# EAGLE design 4port_driver (EAGLE 6.2)
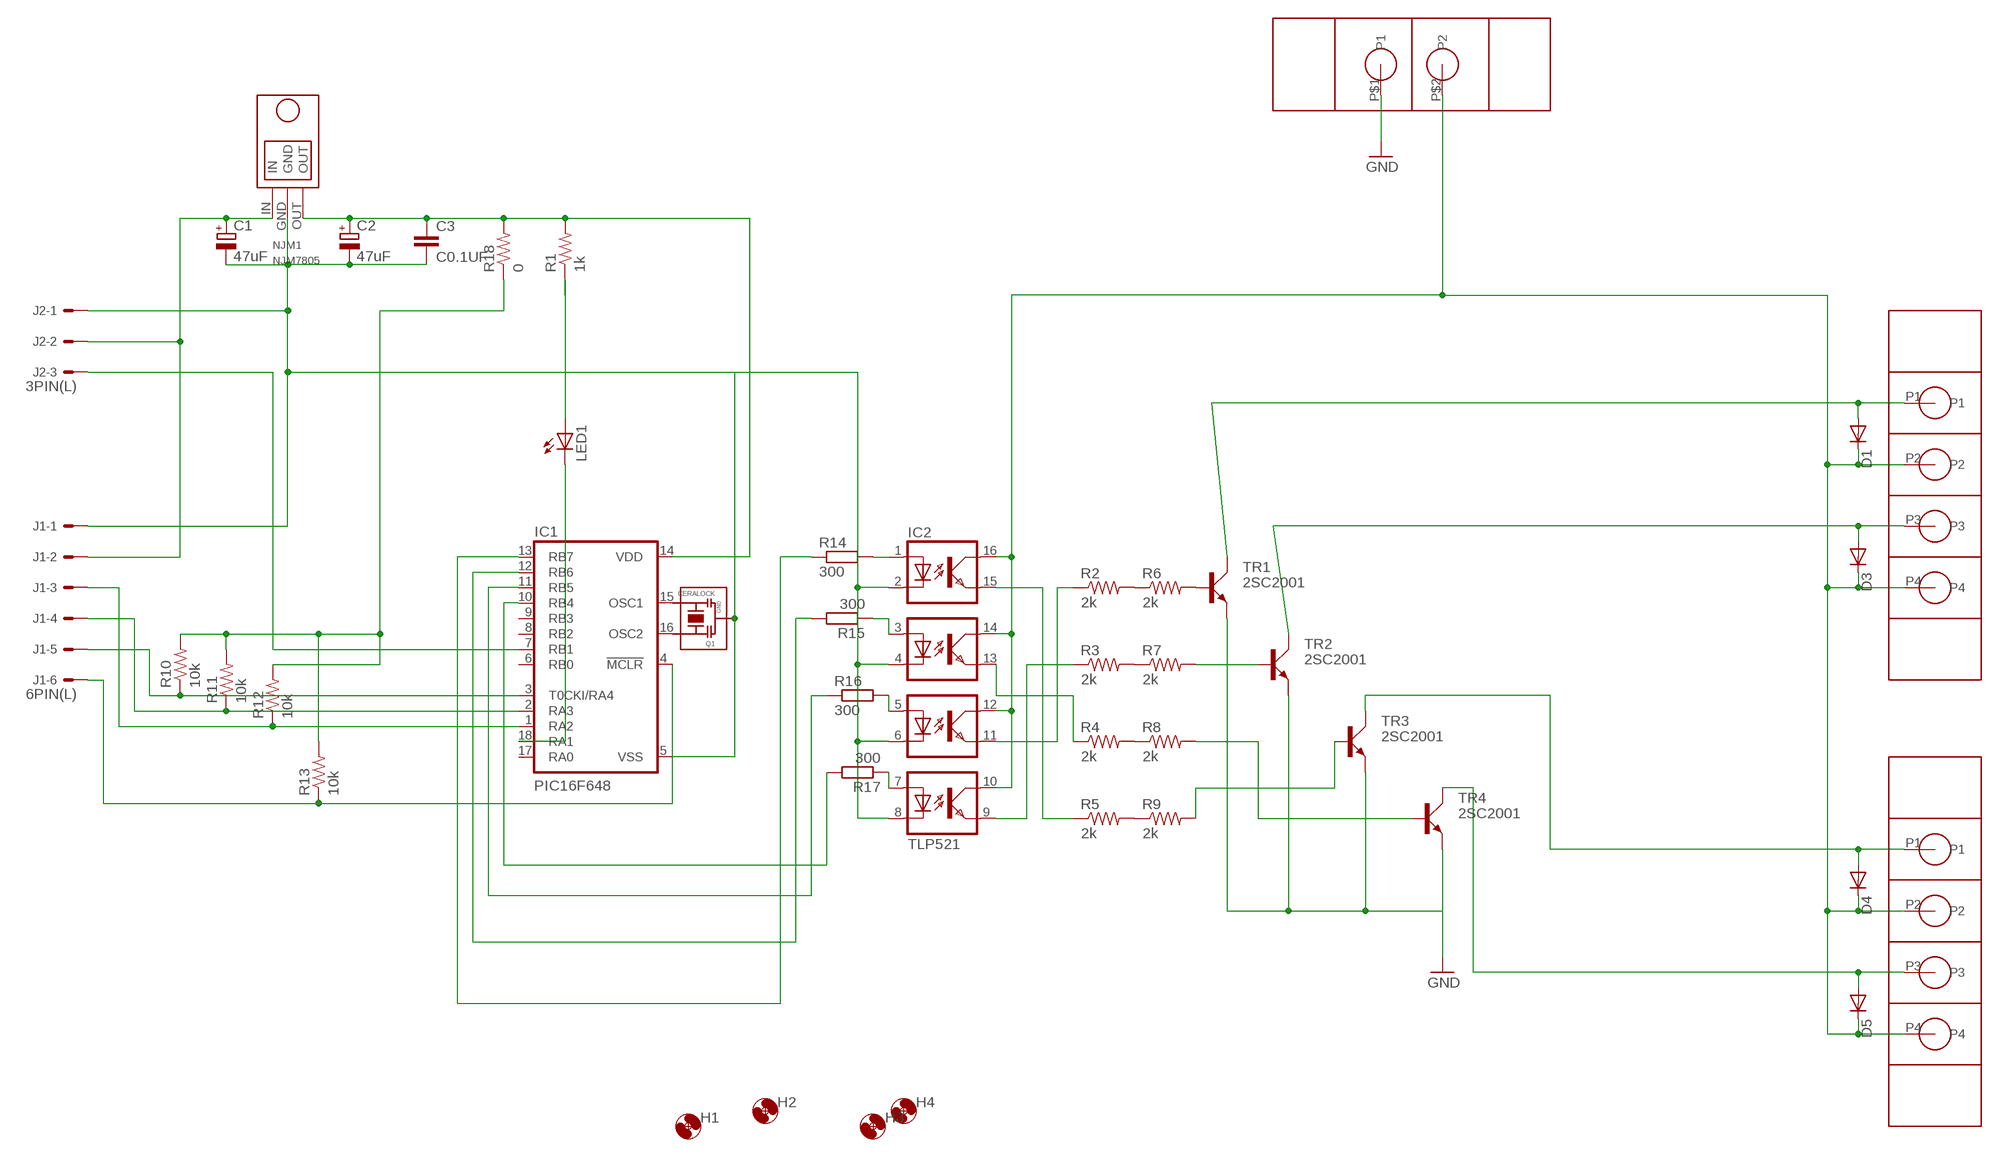
[diagram p0: schematic, sheet 1]

## Parts
C1  47uF  C-ELEC  [C-6MM]
C2  47uF  C-ELEC  [C-6MM]
C3  C0.1UF  [C0.1UF]
D1  DIODE7.5  [DIODE7.5]
D3  DIODE7.5  [DIODE7.5]
D4  DIODE7.5  [DIODE7.5]
D5  DIODE7.5  [DIODE7.5]
H1  HOLE3.3M3BOLT  [HOLE3.3]
H2  HOLE3.3M3BOLT  [HOLE3.3]
H3  HOLE3.3M3BOLT  [HOLE3.3]
H4  HOLE3.3M3BOLT  [HOLE3.3]
IC1  PIC16F648  [DIL18]
IC2  TLP521  [DIL16]
J1  6PIN(L)  [6PL]
J2  3PIN(L)  [3PL]
LED1  LED  [LED5MM]
NJM1  NJM7805  [NJM7805]
Q1  CERALOCK  [CERALOCK]
R1  1k  R-  [0207/10]
R2  2k  R-  [0207/10]
R3  2k  R-  [0207/10]
R4  2k  R-  [0207/10]
R5  2k  R-  [0207/10]
R6  2k  R-  [0207/10]
R7  2k  R-  [0207/10]
R8  2k  R-  [0207/10]
R9  2k  R-  [0207/10]
R10  10k  R-  [0207/10]
R11  10k  R-  [0207/10]
R12  10k  R-  [0207/10]
R13  10k  R-  [0207/10]
R14  300  R-EU2R0207V  [R0207V]
R15  300  R-EU2R0207V  [R0207V]
R16  300  R-EU2R0207V  [R0207V]
R17  300  R-EU2R0207V  [R0207V]
R18  0  R-  [0207/10]
TR1  2SC2001  [TO92BCE]
TR2  2SC2001  [TO92BCE]
TR3  2SC2001  [TO92BCE]
TR4  2SC2001  [TO92BCE]
U$1  BP341L_1  [BP341L]
U$2  BP341L  [BP341L]
U$3  BP341L  [BP341L]

## Nets
GND: TR1.E TR2.E TR3.E TR4.E U$1.P$1(P1)
N$1: C1.+ J1.2 J2.2 NJM1.IN
N$2: C1.- C2.- C3.2 IC1.5(VSS) IC2.2(C0) IC2.4(C1) IC2.6(C2) IC2.8(C3) J1.1 J2.1 NJM1.GND Q1.P$2
N$3: R10.2 R11.2 R12.2 R13.2 R18.1
N$4: IC1.16(OSC2) Q1.P$1
N$5: IC1.15(OSC1) Q1.P$3
N$6: IC1.7(RB1) J2.3
N$7: IC1.1(RA2) J1.3 R12.1
N$8: IC1.2(RA3) J1.4 R11.1
N$9: IC1.3(T0CKI/RA4) J1.5 R10.1
N$10: IC1.4(!MCLR) J1.6 R13.1
N$11: IC1.10(RB4) R17.2
N$12: C2.+ C3.1 IC1.14(VDD) NJM1.OUT R1.2 R18.2
N$13: IC1.12(RB6) R15.2
N$14: IC2.15(EMIT0) R5.1
N$15: LED1.A R1.1
N$16: IC1.18(RA1) LED1.K(C)
N$17: R8.2 TR4.B
N$18: IC2.13(EMIT1) R4.1
N$19: IC2.11(EMIT2) R2.1
N$20: IC2.9(EMIT3) R3.1
N$21: R6.2 TR1.B
N$22: R2.2 R6.1
N$23: R3.2 R7.1
N$24: R4.2 R8.1
N$25: D1.PA(A) TR1.C U$2.P1
N$26: D3.PA(A) TR2.C U$2.P3
N$27: D4.PA(A) TR3.C U$3.P1
N$28: R5.2 R9.1
N$29: IC2.1(A0) R14.2
N$30: R7.2 TR2.B
N$31: R9.2 TR3.B
N$32: IC2.3(A1) R15.1
N$33: D1.PK(C) D3.PK(C) D4.PK(C) D5.PK(C) IC2.10(COL3) IC2.12(COL2) IC2.14(COL1) IC2.16(COL0) U$1.P$2(P2) U$2.P2 U$2.P4 U$3.P2 U$3.P4
N$34: IC2.5(A2) R16.2
N$35: D5.PA(A) TR4.C U$3.P3
N$36: IC2.7(A3) R17.1
N$38: IC1.13(RB7) R14.1
N$40: IC1.11(RB5) R16.1
Unconnected: IC1.6(RB0) IC1.8(RB2) IC1.9(RB3) IC1.17(RA0)

## Library data of the parts
C1 C2 = My_rcl:C-ELEC
C3 = FP-21T for MITS:C0.1UF
D1 D3-D5 = diode:DIODE7.5
H1-H4 = FP-21T for MITS:HOLE3.3
IC1 = FP-21T for MITS:PIC16F648
IC2 = FP-21T for MITS:TLP521
J1 = my_connector:6PIN(L)
J2 = my_connector:3PIN(L)
LED1 = my_led:LED: LED
NJM1 = My_NJM7805:NJM7805
Q1 = FP-21T for MITS:CERALOCK: CERALOCK CERAMIC RESONATOR
R1-R13 R18 = My_rcl:R-: Resistor
R14-R17 = FP-21T for MITS:R-EU2
TR1-TR4 = My_transistor:2SC2001: NPN Transistor
U$1 = BP341L_1:BP341L_1
U$2 U$3 = BP341_4PIN:BP341L

## Board
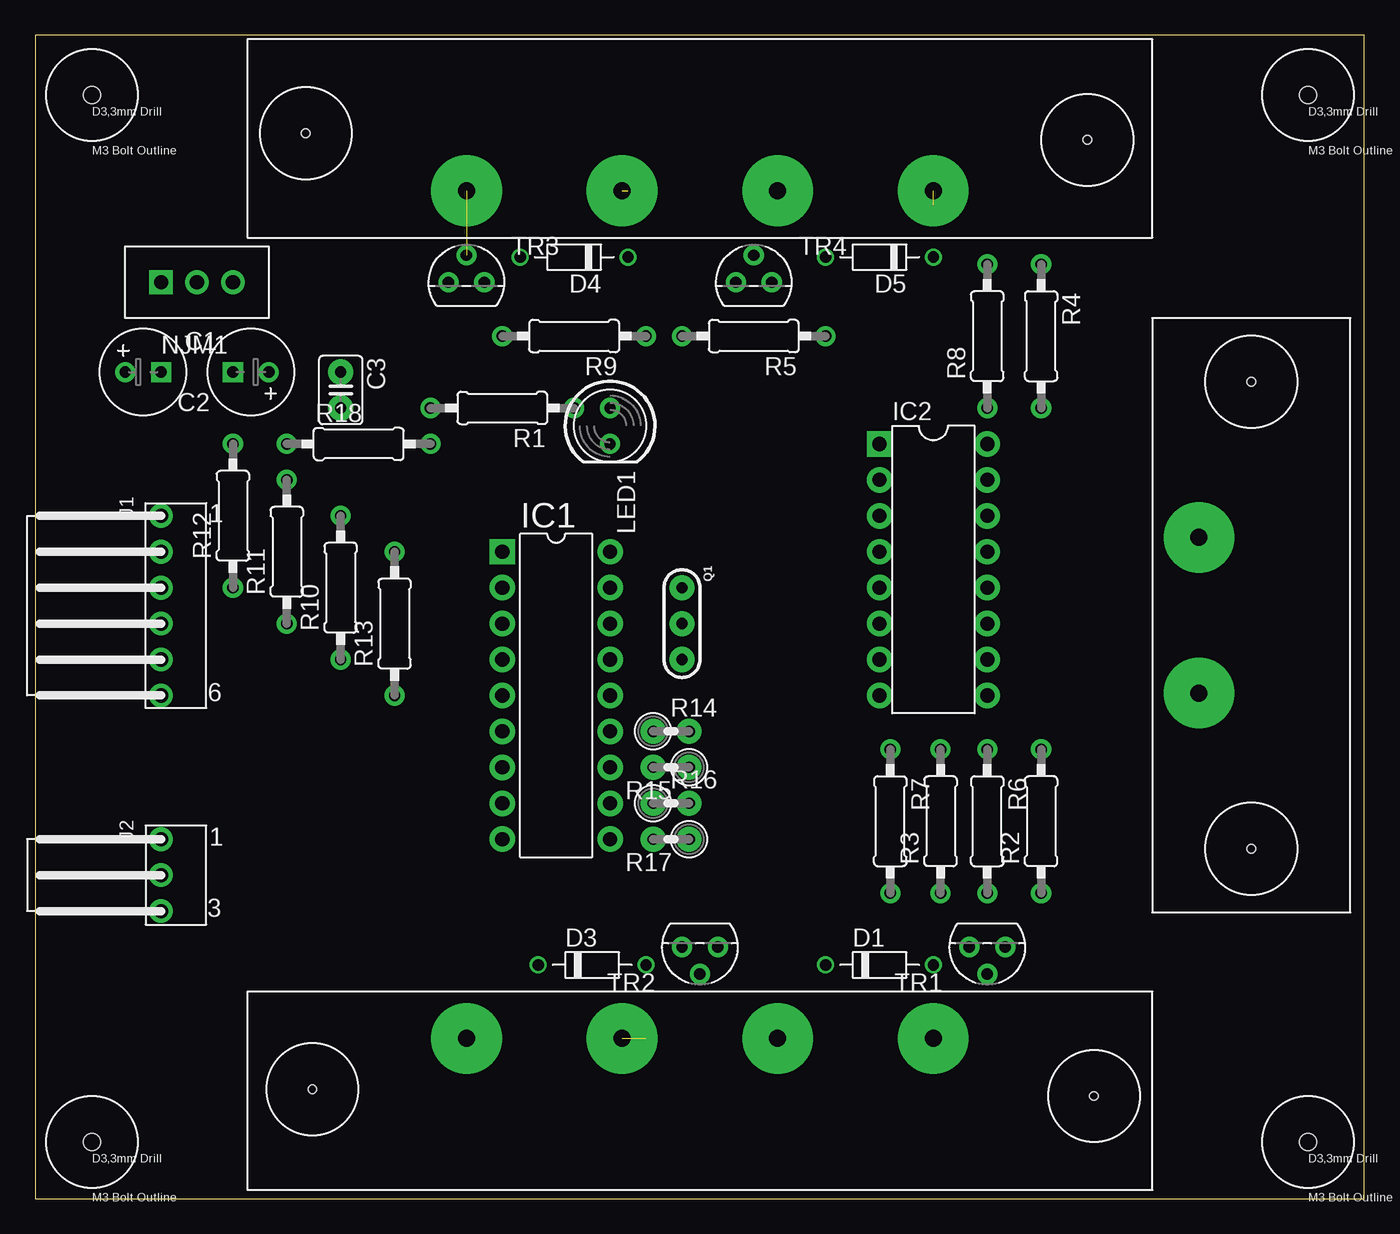
[diagram p1: board, top side]
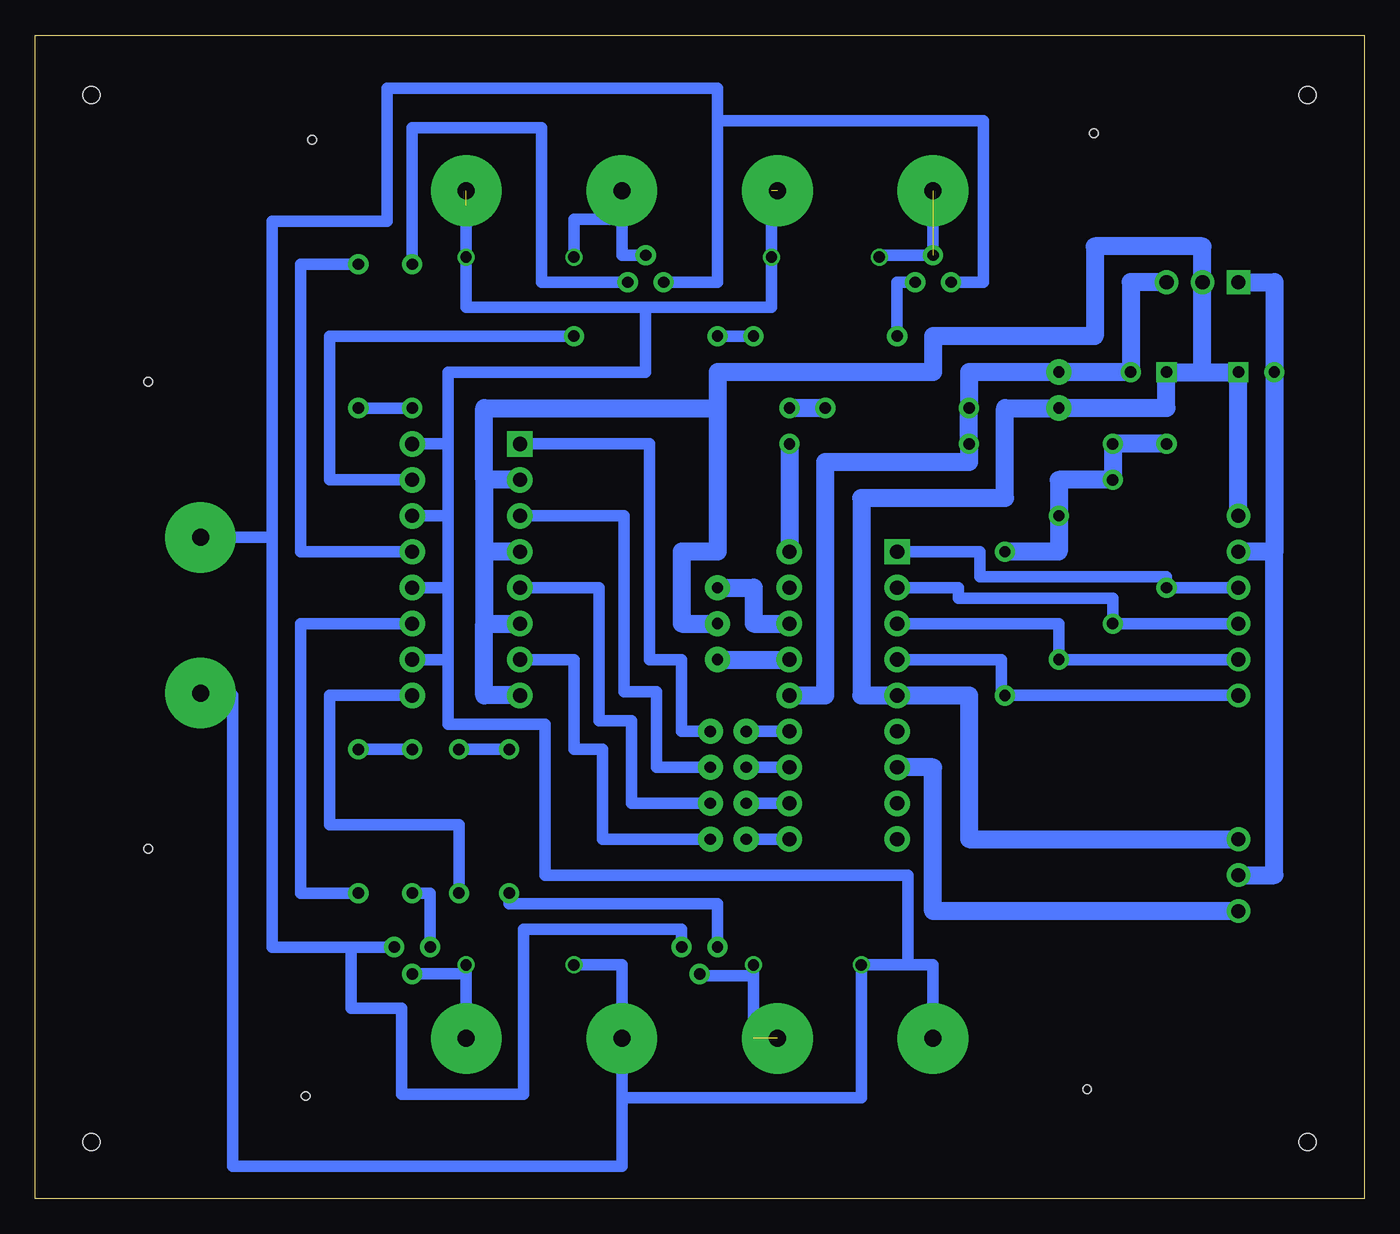
[diagram p2: board, bottom side, seen from below]

Size 93.96 x 82.22 mm. Coordinates in mm from the lower left corner, seen from the top.
Outline: 0,0 93.96,0 93.96,82.22 0,82.22 0,0
Copper layers (1*16): Top 0.035mm / dielectric 1.5mm / Bottom 0.035mm
Design rules: minimum track width 0.15mm, minimum drill 0.3mm, track to track 0.15mm, track to pad 0.15mm, pad to pad 0.15mm, via to via 0.15mm, smd to smd 0.15mm, copper to edge 0.7mm, drill to drill 0.45mm, minimum pad ring 0.15mm, minimum via ring 0.15mm, stop-mask expansion 4mil, vias tented up to drill 0mil, thermal gap 0.15mm

### Footprints (pad centres in the part's own frame; a part is rotated, then mirrored left to right if it is on the bottom)
C-6MM = drill 0.8 pad 1.422: + -1.27,0 | drill 0.8 pad 1.422 square: - 1.27,0
C0.1UF = drill 0.8 pad 1.778: 1 -1.27,0; 2 1.27,0
DIODE7.5 = drill 0.8: PA 3.81,0; PK -3.81,0
HOLE3.3 = hole 1.2: 0,0
DIL18 = drill 1 pad 1.8 square: 1 -10.16,-3.81 | drill 1 pad 1.8: 2 -7.62,-3.81; 3 -5.08,-3.81; 4 -2.54,-3.81; 5 0,-3.81; 6 2.54,-3.81; 7 5.08,-3.81; 8 7.62,-3.81; 9 10.16,-3.81; 10 10.16,3.81; 11 7.62,3.81; 12 5.08,3.81; 13 2.54,3.81; 14 0,3.81; 15 -2.54,3.81; 16 -5.08,3.81; 17 -7.62,3.81; 18 -10.16,3.81
DIL16 = drill 1 pad 1.8 square: 1 -8.89,-3.81 | drill 1 pad 1.8: 2 -6.35,-3.81; 3 -3.81,-3.81; 4 -1.27,-3.81; 5 1.27,-3.81; 6 3.81,-3.81; 7 6.35,-3.81; 8 8.89,-3.81; 9 8.89,3.81; 10 6.35,3.81; 11 3.81,3.81; 12 1.27,3.81; 13 -1.27,3.81; 14 -3.81,3.81; 15 -6.35,3.81; 16 -8.89,3.81
6PL = drill 1 pad 1.676: 1 6.35,3.81; 2 3.81,3.81; 3 1.27,3.81; 4 -1.27,3.81; 5 -3.81,3.81; 6 -6.35,3.81
3PL = drill 1 pad 1.676: 1 2.54,3.81; 2 0,3.81; 3 -2.54,3.81
LED5MM = drill 0.8 pad 1.422: A -1.27,0; K 1.27,0
NJM7805 = drill 1 pad 1.676: GND 0,0; OUT 2.54,0 | drill 1 pad 1.676 square: IN -2.54,0
CERALOCK = drill 0.8 pad 1.778: P$1 -2.54,0; P$2 0,0; P$3 2.54,0
0207/10 = drill 0.8 pad 1.422: 1 -5.08,0; 2 5.08,0
R0207V = drill 0.8 pad 1.778: 1 -1.27,0; 2 1.27,0
TO92BCE = drill 0.8 pad 1.422: B 1.27,0; C 0,1.905; E -1.27,0
BP341L = drill 1.2 pad 5: P$1 -5.499,-3.698; P$2 5.499,-3.698 | hole 0.6: -16.5,0; 16.5,0
BP341L' = drill 1.2 pad 5: P1 -16.5,-3.7; P2 -5.5,-3.7; P3 5.5,-3.7; P4 16.5,-3.7 | hole 0.6: -27.87,0.37; 27.4,-0.1

### Placement (x,y rotation side)
C1  7.62,58.42 0 top
C2  15.24,58.42 180 top
C3  21.59,57.15 270 top
D1  59.69,16.51 0 top
D3  39.37,16.51 0 top
D4  38.1,66.55 180 top
D5  59.69,66.55 180 top
H1  4,4 0 top
H2  4,78 0 top
H3  90,78 0 top
H4  90,4 0 top
IC1  36.83,35.56 270 top
IC2  63.5,44.45 270 top
J1  12.7,41.91 90 top
J2  12.7,22.86 90 top
LED1  40.64,54.61 270 top
NJM1  11.43,64.77 0 top
Q1  45.72,40.64 270 top
R1  33.02,55.88 180 top
R2  71.12,26.67 90 top
R3  64.01,26.67 90 top
R4  71.12,60.96 270 top
R5  50.8,60.96 180 top
R6  67.31,26.67 270 top
R7  60.45,26.67 270 top
R8  67.31,60.96 90 top
R9  38.1,60.96 180 top
R10  21.59,43.18 90 top
R11  17.78,45.72 90 top
R12  13.97,48.26 90 top
R13  25.4,40.64 90 top
R14  44.96,33.02 0 top
R15  44.96,30.48 180 top
R16  44.96,27.94 0 top
R17  44.96,25.4 180 top
R18  22.86,53.34 0 top
TR1  67.31,17.78 180 top
TR2  46.99,17.78 180 top
TR3  30.48,64.77 0 top
TR4  50.8,64.77 0 top
U$1  85.98,41.23 270 top
U$2  BP341L  [BP341L']  46.99,7.62 180 top
U$3  BP341L  [BP341L']  46.99,74.93 0 top

### Tracks (layer width: path | path; a pad name or v marks a point on that pad's centre or on a via)
GND
  Bottom 0.813: 71.63,17.78 TR1.E | 71.63,17.78 71.63,13.46 68.07,13.46 68.07,7.37 59.44,7.37 59.44,19.05 48.26,19.05 TR2.E | 45.72,76.2 26.92,76.2 26.92,64.77 TR3.E | 45.72,76.2 45.72,64.77 TR4.E | 45.72,76.2 45.72,78.49 69.09,78.49 69.09,69.09 77.22,69.09 77.22,46.99 77.22,46.73 | 77.22,46.73 77.22,17.78 71.63,17.78 | U$1.P$1 77.22,46.73
N$1
  Bottom 1.27: J2.2 6.35,22.86 6.35,45.72 | 6.35,45.72 J1.2 | 6.35,45.72 C1.+ 6.35,64.77 NJM1.IN
N$2
  Bottom 1.27: J1.1 C1.- 11.43,58.42 | J2.1 27.94,25.4 27.94,35.56 IC1.5 35.56,35.56 35.56,49.53 25.4,49.53 25.4,55.88 C3.2 13.97,55.88 C2.- 11.43,58.42 | 11.43,58.42 NJM1.GND 11.43,67.31 19.05,67.31 19.05,60.96 30.48,60.96 30.48,58.42 45.72,58.42 45.72,55.88 | 45.72,55.88 45.72,45.72 48.26,45.72 48.26,40.64 Q1.P$2 | 62.23,50.8 62.23,55.88 45.72,55.88 | IC2.2 62.23,50.8 | 62.23,50.8 62.23,45.72 | IC2.4 62.23,45.72 | 62.23,45.72 62.23,40.64 | 62.23,40.64 IC2.6 | IC2.8 62.23,35.56 62.23,40.64
N$3
  Bottom 1.27: R12.2 R18.1 R11.2 21.59,50.8 R10.2 21.59,45.72 R13.2
N$4
  Bottom 1.27: Q1.P$1 43.18,43.18 43.18,40.64 IC1.16
N$5
  Bottom 1.27: Q1.P$3 IC1.15
N$6
  Bottom 1.27: J2.3 30.48,20.32 30.48,30.48 IC1.7
N$7
  Bottom 0.813: IC1.1 27.18,45.72 27.18,43.94 13.97,43.94 R12.1 J1.3
N$8
  Bottom 0.813: IC1.2 28.7,43.18 28.7,42.42 17.78,42.42 R11.1 J1.4
N$9
  Bottom 0.813: IC1.3 21.59,40.64 R10.1 J1.5
N$10
  Bottom 0.813: IC1.4 25.65,38.1 25.65,35.56 R13.1 J1.6
N$11
  Bottom 0.813: IC1.10 R17.2
N$12
  Bottom 1.27: NJM1.OUT 16.51,64.77 C2.+ C3.1 27.94,58.42 R1.2 R18.2 27.94,52.07 38.1,52.07 38.1,35.56 IC1.14
N$13
  Bottom 0.813: R15.2 IC1.12
N$14
  Bottom 0.813: IC2.15 73.15,50.8 73.15,60.96 R5.1
N$15
  Bottom 1.27: R1.1 LED1.A
N$16
  Bottom 1.27: LED1.K IC1.18
N$17
  Bottom 0.813: TR4.B 58.17,64.77 58.17,75.69 67.31,75.69 R8.2
N$18
  Bottom 0.813: R4.1 75.18,66.04 75.18,45.72 IC2.13
N$19
  Bottom 0.813: IC2.11 75.18,40.64 75.18,21.59 R2.1
N$20
  Bottom 0.813: R3.1 64.01,26.42 73.15,26.42 73.15,35.56 IC2.9
N$21
  Bottom 0.813: TR1.B 66.04,21.59 R6.2
N$22
  Bottom 0.813: R2.2 R6.1
N$23
  Bottom 0.813: R7.1 R3.2
N$24
  Bottom 0.813: R8.1 R4.2
N$25
  Bottom 0.813: TR1.C 63.5,15.88 | 63.5,15.88 D1.PA | 63.5,15.88 63.49,15.88 U$2.P1
N$26  (1 unrouted)
  Bottom 0.813: 43.18,11.32 43.18,15.75 | D3.PA 43.18,15.75 | 43.18,15.75 46.99,15.75 TR2.C
N$27  (1 unrouted)
  Bottom 0.813: 30.48,70.21 TR3.C 34.29,66.67 D4.PA
N$28
  Bottom 0.813: R9.1 R5.2
N$29
  Bottom 0.813: IC2.1 50.55,53.34 50.55,38.1 48.26,38.1 48.26,33.02 R14.2
N$30
  Bottom 0.813: TR2.B 45.72,20.83 60.45,20.83 R7.2
N$31
  Bottom 0.813: TR3.B 33.02,64.77 R9.2
N$32
  Bottom 0.813: IC2.3 52.32,48.26 52.32,35.81 50.04,35.81 50.04,30.73 50.04,30.48 R15.1
N$33  (2 unrouted)
  Bottom 0.813: 32.26,16.51 D3.PK 35.56,7.11 52.49,7.11 | 32.26,16.51 30.49,16.51 U$2.P4 | D1.PK 52.49,16.51 U$2.P2 52.49,7.11 | IC2.10 64.77,38.1 | 64.77,38.1 64.77,43.18 | IC2.12 64.77,43.18 | 64.77,43.18 64.77,48.26 | IC2.14 64.77,48.26 | 64.77,48.26 64.77,53.34 | 64.77,53.34 IC2.16 | 64.77,38.1 64.77,33.53 57.91,33.53 57.91,22.86 32.26,22.86 32.26,16.51 | 64.77,53.34 64.77,58.42 50.8,58.42 50.8,62.99 | 52.49,7.11 52.49,2.29 80.01,2.29 80.01,35.56 82.28,35.56 U$1.P$2 | 50.8,62.99 41.91,62.99 D4.PK 41.91,71.23 | 63.5,70.21 D5.PK 63.5,62.99 50.8,62.99
N$34
  Bottom 0.813: R16.2 51.82,27.94 51.82,33.78 54.1,33.78 54.1,43.18 IC2.5
N$35
  Bottom 0.813: 52.49,69.22 55.88,69.22 D5.PA | TR4.C 52.49,66.67 52.49,68.58 52.49,69.22 | U$3.P3 52.49,69.22
N$36
  Bottom 0.813: R17.1 53.85,25.4 53.85,31.75 55.88,31.75 55.88,38.1 IC2.7
N$38
  Bottom 0.813: R14.1 IC1.13
N$40
  Bottom 0.813: R16.1 IC1.11